# EAGLE design ATtiny13 (EAGLE 7.2.0)
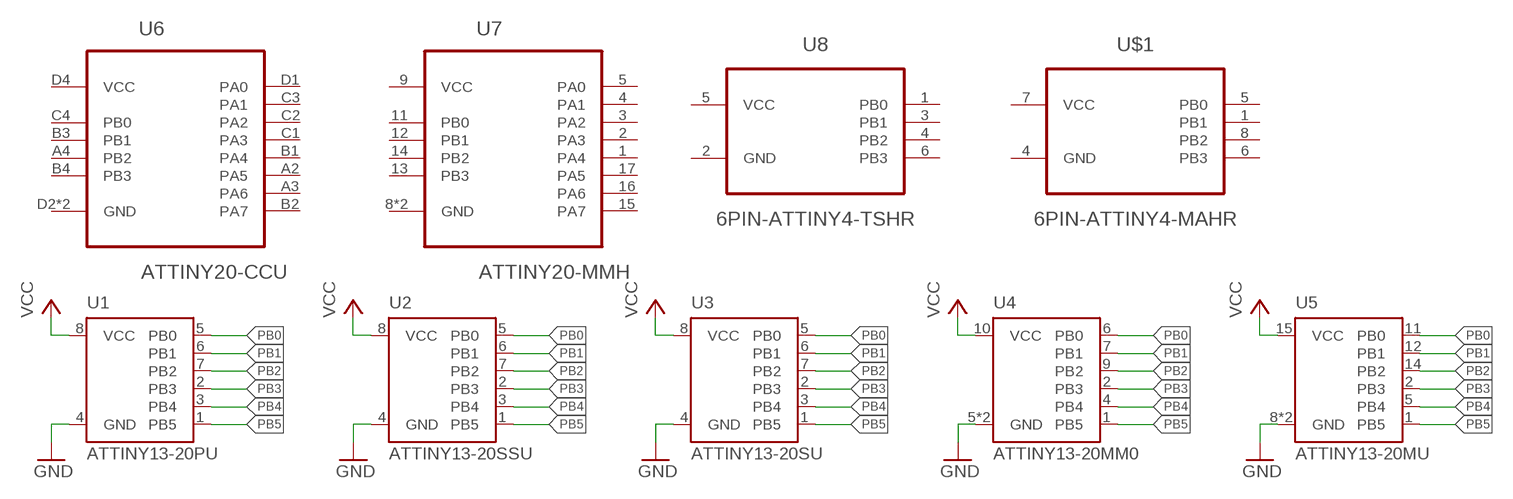
[diagram p0: schematic, sheet 1]

## Parts
U1  ATTINY13-20PU  [8P3]
U2  ATTINY13-20SSU  [8S1]
U3  ATTINY13-20SU  [8S2]
U4  ATTINY13-20MM0  [10M1]
U5  ATTINY13-20MU  [20M1]
U6  ATTINY20-CCU  [15CC1]
U7  ATTINY20-MMH  [20M2]
U8  6PIN-ATTINY4-TSHR  [6ST1]
U$1  6PIN-ATTINY4-MAHR  [8MA4]

## Nets
GND: U1.4(GND) U2.4(GND) U3.4(GND) U4.5(GND) U4.11(GND) U5.8(GND) U5.21(GND)
PB0: U1.5(PB0) U2.5(PB0) U3.5(PB0) U4.6(PB0) U5.11(PB0)
PB1: U1.6(PB1) U2.6(PB1) U3.6(PB1) U4.7(PB1) U5.12(PB1)
PB2: U1.7(PB2) U2.7(PB2) U3.7(PB2) U4.9(PB2) U5.14(PB2)
PB3: U1.2(PB3) U2.2(PB3) U3.2(PB3) U4.2(PB3) U5.2(PB3)
PB4: U1.3(PB4) U2.3(PB4) U3.3(PB4) U4.4(PB4) U5.5(PB4)
PB5: U1.1(PB5) U2.1(PB5) U3.1(PB5) U4.1(PB5) U5.1(PB5)
VCC: U1.8(VCC) U2.8(VCC) U3.8(VCC) U4.10(VCC) U5.15(VCC)
Unconnected: U6.A2(PA5) U6.A3(PA6) U6.A4(PB2) U6.B1(PA4) U6.B2(PA7) U6.B3(PB1) U6.B4(PB3) U6.C1(PA3) U6.C2(PA2) U6.C3(PA1) U6.C4(PB0) U6.D1(PA0) U6.D2(GND) U6.D3(GND) U7.1(PA4) U7.2(PA3) U7.3(PA2) U7.4(PA1) U7.5(PA0) U7.8(GND) U7.11(PB0) U7.12(PB1) U7.13(PB3) U7.14(PB2) U7.15(PA7) U7.16(PA6) U7.17(PA5) U7.21(GND) U8.1(PB0) U8.2(GND) U8.3(PB1) U8.4(PB2) U8.6(PB3) U$1.1(PB1) U$1.4(GND) U$1.5(PB0) U$1.6(PB3) U$1.8(PB2)

## Power pins joined to a net without a drawn wire
VCC: U6.D4(VCC) U7.9(VCC) U8.5(VCC) U$1.7(VCC)

## Library data of the parts
U1 = Atmel AVR8:ATTINY13: 8-bit AVR Microcontroller with 1K Bytes In-System Programmable Flash Source: http://www.atmel.com/dyn/resources/prod_documents/2535S.pdf; MPN: ATTINY13-20PU; OC_FARNELL: 9171550; OC_NEWARK: 96K6521
U2 = Atmel AVR8:ATTINY13: 8-bit AVR Microcontroller with 1K Bytes In-System Programmable Flash Source: http://www.atmel.com/dyn/resources/prod_documents/2535S.pdf; MPN: ATTINY13-20SSU; OC_FARNELL: 1455133; OC_NEWARK: 58M3771
U3 = Atmel AVR8:ATTINY13: 8-bit AVR Microcontroller with 1K Bytes In-System Programmable Flash Source: http://www.atmel.com/dyn/resources/prod_documents/2535S.pdf; MPN: ATTINY13-20SU; OC_FARNELL: 9171568; OC_NEWARK: 96K6522
U4 = Atmel AVR8:ATTINY13: 8-bit AVR Microcontroller with 1K Bytes In-System Programmable Flash Source: http://www.atmel.com/dyn/resources/prod_documents/2535S.pdf; MPN: ATTINY13A-MMU; OC_FARNELL: 1715516; OC_NEWARK: 15R0298
U5 = Atmel AVR8:ATTINY13: 8-bit AVR Microcontroller with 1K Bytes In-System Programmable Flash Source: http://www.atmel.com/dyn/resources/prod_documents/2535S.pdf; MPN: ATTINY13A-MU; OC_FARNELL: 1715517; OC_NEWARK: 15R0299
U6 U7 = Atmel AVR8:ATTINY20: 8-bit Microcontroller with Bytes In-System Programmable Flash
U8 = Atmel AVR8:6PIN-ATTINY: 8-bit Microcontroller with In-System Programmable Flash; ADC: no; DESCRIPTION: 0x1E 0x8F 0x0A; FLASH: 512 bytes; MPN: ATTINY4-TSHR; OC_FARNELL: 1841625; OC_NEWARK: 12T1337; PACKAGE: SOT-23-6; SUPPLIER: Atmel
U$1 = Atmel AVR8:6PIN-ATTINY: 8-bit Microcontroller with In-System Programmable Flash; ADC: no; DESCRIPTION: 0x1E 0x8F 0x0A; FLASH: 512 bytes; MPN: ATTINY4-MAHR; PACKAGE: UDFN8; SUPPLIER: Atmel

## Board
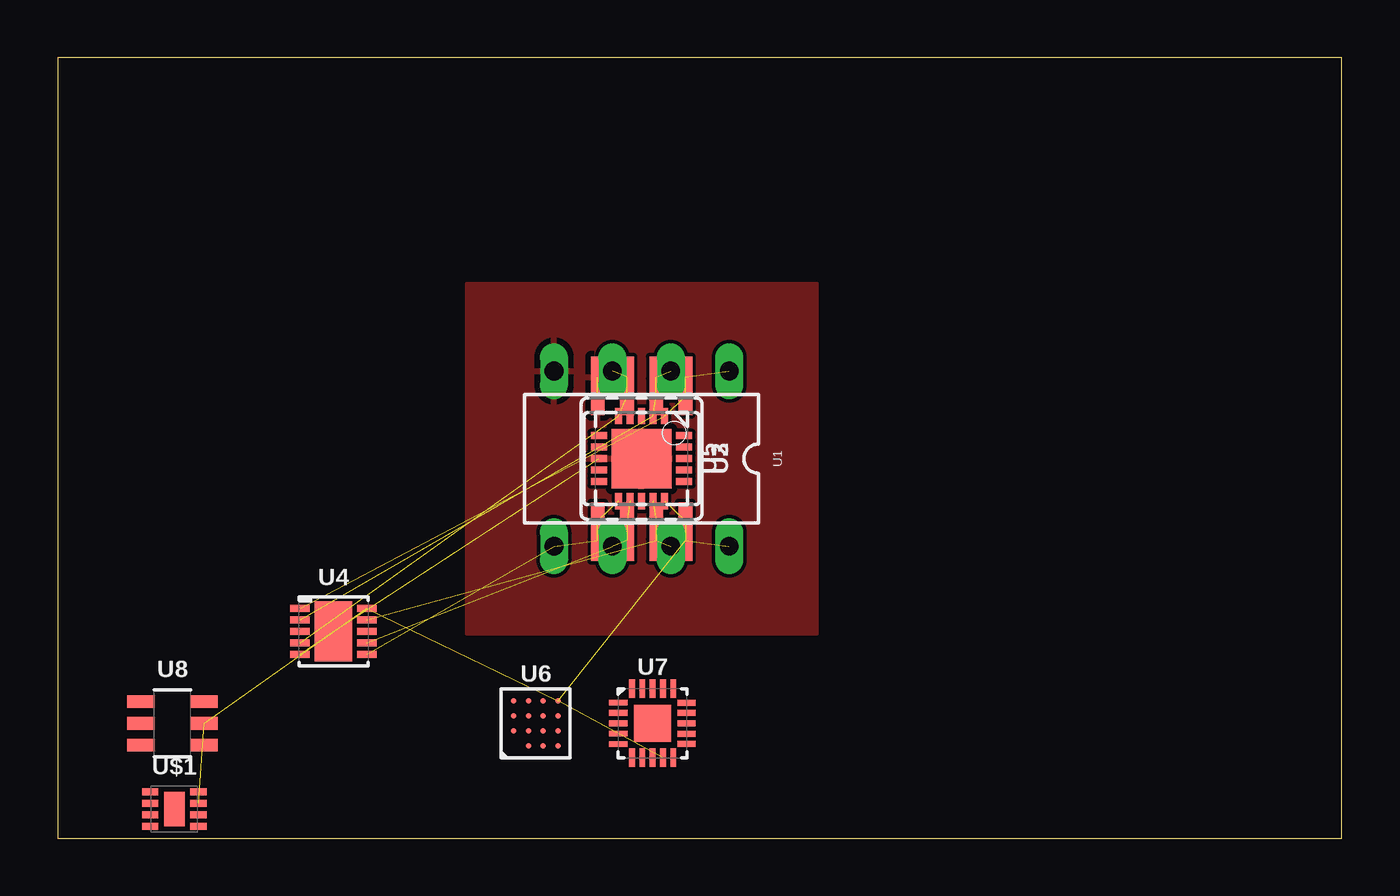
[diagram p1: board, top side]

Size 55.86 x 33.96 mm. Coordinates in mm from the lower left corner, seen from the top.
Outline: 0,0 55.86,0 55.86,33.96 0,33.96 0,0
Copper layers (1*16): Top 0.0356mm / dielectric 1.5011mm / Bottom 0.0356mm
Design rules "oshpark-2layer": minimum track width 6mil, minimum drill 13mil, track to track 6mil, track to pad 6mil, pad to pad 6mil, via to via 6mil, smd to smd 6mil, copper to edge 15mil, drill to drill 6mil, minimum pad ring 7mil, minimum via ring 7mil, stop-mask expansion 4mil, vias tented up to drill 0mil, thermal gap 10mil

### Footprints (pad centres in the part's own frame; a part is rotated, then mirrored left to right if it is on the bottom)
8P3 = drill 0.813 long: 1 -3.81,3.81; 2 -3.81,1.27; 3 -3.81,-1.27; 4 -3.81,-3.81; 5 3.81,-3.81; 6 3.81,-1.27; 7 3.81,1.27; 8 3.81,3.81
8S1 = smd 1.6 x 0.6: 1 -2.7,1.905; 2 -2.7,0.635; 3 -2.7,-0.635; 4 -2.7,-1.905; 5 2.7,-1.905; 6 2.7,-0.635; 7 2.7,0.635; 8 2.7,1.905
8S2 = smd 1.8 x 0.6: 1 -3.55,1.905; 2 -3.55,0.635; 3 -3.55,-0.635; 4 -3.55,-1.905; 5 3.55,-1.905; 6 3.55,-0.635; 7 3.55,0.635; 8 3.55,1.905
10M1 = smd 0.85 x 0.3: 1 -1.45,1; 2 -1.45,0.5; 3 -1.45,0; 4 -1.45,-0.5; 5 -1.45,-1; 6 1.45,-1; 7 1.45,-0.5; 8 1.45,0; 9 1.45,0.5; 10 1.45,1 | smd 1.64 x 2.6: 11 0,0
20M1 = smd 0.7 x 0.3: 1 -1.85,1; 2 -1.85,0.5; 3 -1.85,0; 4 -1.85,-0.5; 5 -1.85,-1; 11 1.85,-1; 12 1.85,-0.5; 13 1.85,0; 14 1.85,0.5; 15 1.85,1 | smd 0.3 x 0.7: 6 -1,-1.85; 7 -0.5,-1.85; 8 0,-1.85; 9 0.5,-1.85; 10 1,-1.85; 16 1,1.85; 17 0.5,1.85; 18 0,1.85; 19 -0.5,1.85; 20 -1,1.85 | smd 2.6 x 2.6: 21 0,0
15CC1 = smd 0.25 x 0.25: A2 -0.325,-0.975; A3 0.325,-0.975; A4 0.975,-0.975; B1 -0.975,-0.325; B2 -0.325,-0.325; B3 0.325,-0.325; B4 0.975,-0.325; C1 -0.975,0.325; C2 -0.325,0.325; C3 0.325,0.325; C4 0.975,0.325; D1 -0.975,0.975; D2 -0.325,0.975; D3 0.325,0.975; D4 0.975,0.975
20M2 = smd 0.8 x 0.25: 1 -1.5,0.9; 2 -1.5,0.45; 3 -1.5,0; 4 -1.5,-0.45; 5 -1.5,-0.9; 11 1.473,-0.889; 12 1.473,-0.457; 13 1.473,0; 14 1.473,0.457; 15 1.473,0.889 | smd 0.25 x 0.8: 6 -0.9,-1.5; 7 -0.45,-1.5; 8 0,-1.5; 9 0.45,-1.5; 10 0.9,-1.5; 16 0.9,1.5; 17 0.45,1.5; 18 0,1.5; 19 -0.45,1.5; 20 -0.9,1.5 | smd 1.6 x 1.6: 21 0,0
6ST1 = smd 1.2 x 0.55: 1 -1.375,0.95; 2 -1.375,0; 3 -1.375,-0.95; 4 1.375,-0.95; 5 1.375,0; 6 1.375,0.95
8MA4 = smd 0.7 x 0.3: 1 -1.05,0.75; 2 -1.05,0.25; 3 -1.05,-0.25; 4 -1.05,-0.75; 5 1.05,-0.75; 6 1.05,-0.25; 7 1.05,0.25; 8 1.05,0.75 | smd 0.9 x 1.5: THERM 0,0

### Placement (x,y rotation side)
U1  25.4,16.51 270 top
U2  25.4,16.51 270 top
U3  25.4,16.51 270 top
U4  12,9 0 top
U5  25.4,16.51 270 top
U6  20.8,5 0 top
U7  25.88,5 0 top
U8  5,5 0 top
U$1  5.08,1.27 0 top

### Tracks (layer width: path | path; a pad name or v marks a point on that pad's centre or on a via)
GND  (3 unrouted)
  pour Top: 17.78,8.89 33.02,8.89 33.02,24.13 17.78,24.13
PB0  (4 unrouted)
PB1  (4 unrouted)
PB2  (4 unrouted)
PB3  (4 unrouted)
PB4  (4 unrouted)
PB5  (4 unrouted)
VCC  (8 unrouted)